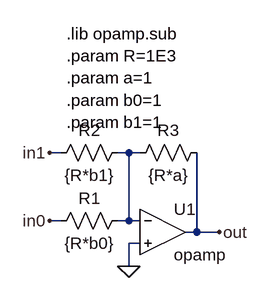
[diagram p0: schematic summer.asc]
summer.asc, the LTspice schematic file:
Version 4
SHEET 1 880 680
WIRE 80 -496 64 -496
WIRE 176 -496 160 -496
WIRE 192 -496 176 -496
WIRE 80 -400 64 -400
WIRE 176 -400 176 -496
WIRE 176 -400 160 -400
WIRE 192 -400 176 -400
WIRE 272 -384 272 -496
WIRE 272 -384 256 -384
WIRE 304 -384 272 -384
WIRE 192 -368 176 -368
WIRE 176 -336 176 -368
FLAG 64 -400 in0
FLAG 304 -384 out
FLAG 176 -336 0
FLAG 64 -496 in1
SYMBOL OpAmps/opamp 224 -448 R0
SYMATTR InstName U1
SYMBOL res 288 -512 R90
WINDOW 0 0 56 VBottom 2
WINDOW 3 32 56 VTop 2
SYMATTR InstName R3
SYMATTR Value {R*a}
SYMBOL res 176 -416 R90
WINDOW 0 0 56 VBottom 2
WINDOW 3 32 56 VTop 2
SYMATTR InstName R1
SYMATTR Value {R*b0}
SYMBOL res 176 -512 R90
WINDOW 0 0 56 VBottom 2
WINDOW 3 32 56 VTop 2
SYMATTR InstName R2
SYMATTR Value {R*b1}
TEXT 88 -664 Left 2 !.lib opamp.sub\n.param R=1E3\n.param a=1\n.param b0=1\n.param b1=1

The netlist it stands for:
* summer.asc
XU1 N001 0 out opamp Aol=100K GBW=10Meg  ; pins invin noninvin out
R3 out N001 {R*a}
R1 N001 in0 {R*b0}
R2 N001 in1 {R*b1}
.lib opamp.sub
.param R=1E3
.param a=1
.param b0=1
.param b1=1
.backanno
.end